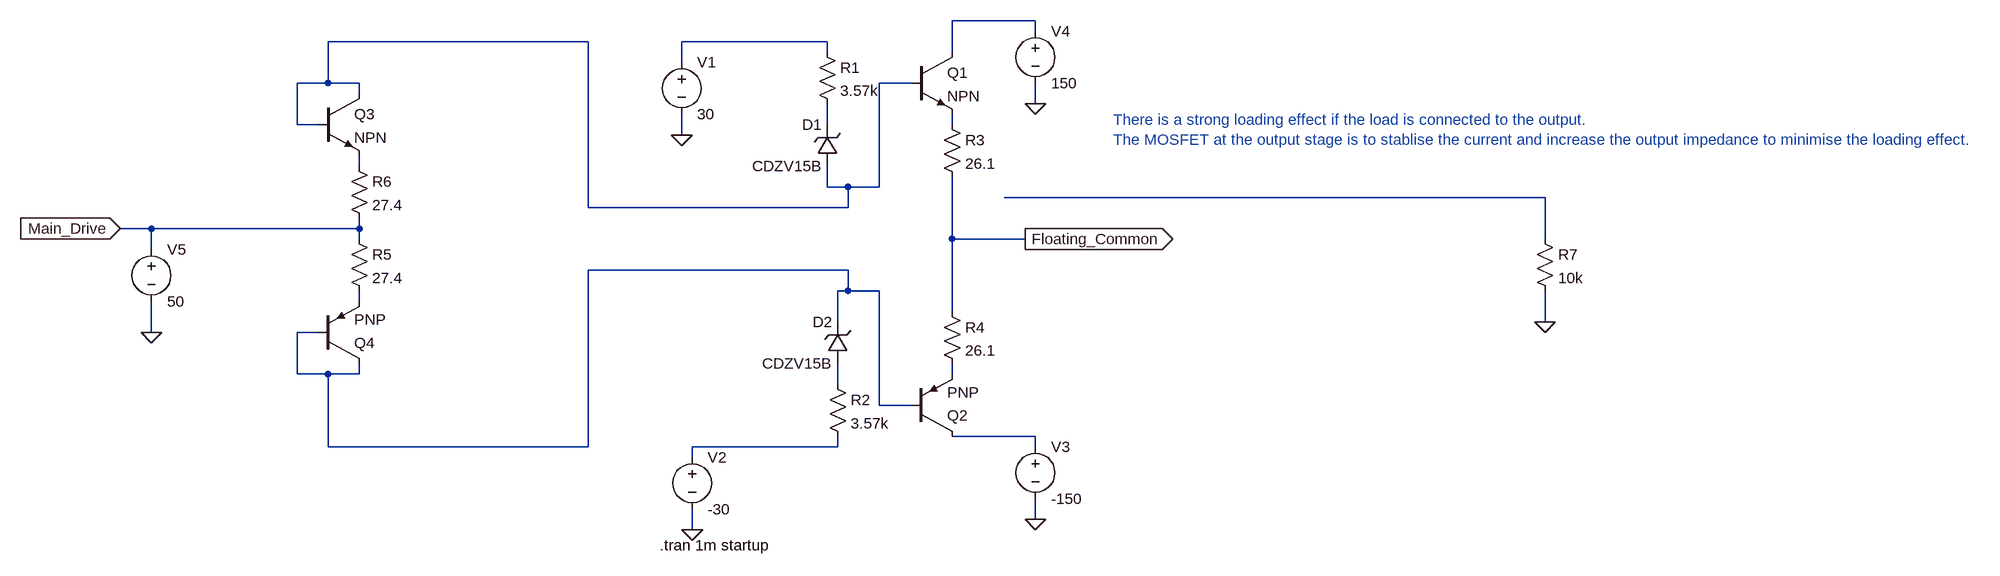
[diagram p0: schematic output-236.asc]
output-236.asc, the LTspice schematic file:
Version 4
SHEET 1 1896 680
WIRE 336 -160 208 -160
WIRE 336 -144 336 -160
WIRE -352 -128 -752 -128
WIRE 16 -128 -208 -128
WIRE 16 -112 16 -128
WIRE 208 -112 208 -160
WIRE -208 -96 -208 -128
WIRE -752 -64 -752 -128
WIRE -752 -64 -800 -64
WIRE -704 -64 -752 -64
WIRE 144 -64 96 -64
WIRE -704 -48 -704 -64
WIRE 336 -32 336 -64
WIRE -800 0 -800 -64
WIRE -768 0 -800 0
WIRE 16 0 16 -32
WIRE 208 0 208 -16
WIRE -208 16 -208 -16
WIRE -704 64 -704 48
WIRE 16 96 16 64
WIRE 48 96 16 96
WIRE 96 96 96 -64
WIRE 96 96 48 96
WIRE 1120 112 288 112
WIRE -352 128 -352 -128
WIRE 48 128 48 96
WIRE 48 128 -352 128
WIRE -1024 160 -1072 160
WIRE -704 160 -704 144
WIRE -704 160 -1024 160
WIRE -704 176 -704 160
WIRE 208 176 208 80
WIRE 320 176 208 176
WIRE 1120 176 1120 112
WIRE -1024 192 -1024 160
WIRE 48 224 -352 224
WIRE 48 256 48 224
WIRE 48 256 32 256
WIRE 96 256 48 256
WIRE -704 272 -704 256
WIRE 208 288 208 176
WIRE 32 304 32 256
WIRE 1120 304 1120 256
WIRE -1024 320 -1024 272
WIRE -768 320 -800 320
WIRE -800 384 -800 320
WIRE -752 384 -800 384
WIRE -704 384 -704 368
WIRE -704 384 -752 384
WIRE 208 384 208 368
WIRE 32 400 32 368
WIRE 96 432 96 256
WIRE 144 432 96 432
WIRE 336 480 208 480
WIRE -752 496 -752 384
WIRE -352 496 -352 224
WIRE -352 496 -752 496
WIRE 32 496 32 480
WIRE 32 496 -192 496
WIRE 336 496 336 480
WIRE -192 512 -192 496
WIRE 336 608 336 576
WIRE -192 624 -192 592
FLAG -192 624 0
FLAG -208 16 0
FLAG 336 -32 0
FLAG 336 608 0
FLAG -1024 320 0
FLAG 320 176 Floating_Common
IOPIN 320 176 Out
FLAG -1072 160 Main_Drive
IOPIN -1072 160 In
FLAG 1120 304 0
SYMBOL npn 144 -112 R0
SYMATTR InstName Q1
SYMBOL pnp 144 480 M180
SYMATTR InstName Q2
SYMBOL res 0 -128 R0
SYMATTR InstName R1
SYMATTR Value 3.57k
SYMBOL res 16 384 R0
SYMATTR InstName R2
SYMATTR Value 3.57k
SYMBOL zener 32 64 R180
WINDOW 0 24 64 Left 2
WINDOW 3 24 0 Left 2
SYMATTR InstName D1
SYMATTR Value CDZV15B
SYMBOL zener 48 368 R180
WINDOW 0 24 64 Left 2
WINDOW 3 24 0 Left 2
SYMATTR InstName D2
SYMATTR Value CDZV15B
SYMBOL voltage -208 -112 R0
WINDOW 123 0 0 Left 0
WINDOW 39 0 0 Left 0
SYMATTR InstName V1
SYMATTR Value 30
SYMBOL voltage -192 496 R0
WINDOW 123 0 0 Left 0
WINDOW 39 0 0 Left 0
SYMATTR InstName V2
SYMATTR Value -30
SYMBOL voltage 336 480 R0
WINDOW 123 0 0 Left 0
WINDOW 39 0 0 Left 0
SYMATTR InstName V3
SYMATTR Value -150
SYMBOL voltage 336 -160 R0
WINDOW 123 0 0 Left 0
WINDOW 39 0 0 Left 0
SYMATTR InstName V4
SYMATTR Value 150
SYMBOL res 192 -16 R0
SYMATTR InstName R3
SYMATTR Value 26.1
SYMBOL res 192 272 R0
SYMATTR InstName R4
SYMATTR Value 26.1
SYMBOL npn -768 -48 R0
SYMATTR InstName Q3
SYMBOL pnp -768 368 M180
SYMATTR InstName Q4
SYMBOL res -720 160 R0
SYMATTR InstName R5
SYMATTR Value 27.4
SYMBOL res -720 48 R0
SYMATTR InstName R6
SYMATTR Value 27.4
SYMBOL voltage -1024 176 R0
WINDOW 123 0 0 Left 0
WINDOW 39 0 0 Left 0
SYMATTR InstName V5
SYMATTR Value 50
SYMBOL res 1104 160 R0
SYMATTR InstName R7
SYMATTR Value 10k
TEXT -242 648 Left 2 !.tran 1m startup
TEXT 456 -8 Left 2 ;There is a strong loading effect if the load is connected to the output.\nThe MOSFET at the output stage is to stablise the current and increase the output impedance to minimise the loading effect.

The netlist it stands for:
* output-236.asc
Q1 N001 N002 N005 0 NPN
Q2 N012 N008 N010 0 PNP
R1 N003 N004 3.57k
R2 N011 N013 3.57k
D1 N002 N004 CDZV15B
D2 N011 N008 CDZV15B
V1 N003 0 30
V2 N013 0 -30
V3 N012 0 -150
V4 N001 0 150
R3 N005 Floating_Common 26.1
R4 Floating_Common N010 26.1
Q3 N002 N002 N006 0 NPN
Q4 N008 N008 N009 0 PNP
R5 Main_Drive N009 27.4
R6 N006 Main_Drive 27.4
V5 Main_Drive 0 50
R7 N007 0 10k
.model D D
.lib standard.dio
.model NPN NPN
.model PNP PNP
.lib standard.bjt
.tran 1m startup
* There is a strong loading effect if the load is connected to the output.
* The MOSFET at the output stage is to stablise the current and increase the output impedance to minimise the loading effect.
.backanno
.end

* Results of the author's LTspice run, read from the files saved beside the schematic
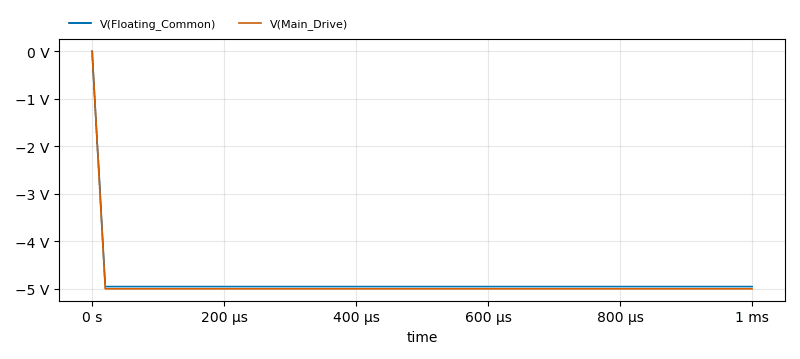
[diagram p1: Transient Analysis of output-236.asc, plotted from the saved traces]
* Transient Analysis, 1 run:
*   V(Floating_Common): min -4.953 V, max 0 V, average -4.903 V, rms 4.919 V, last -4.953 V
*   V(Main_Drive): min -5 V, max 0 V, average -4.95 V, rms 4.967 V, last -5 V